# EasyEDA schematic SCH_ZeeMini - 2652p Board_2021-08-10.json
TITLE: ZeeMini - Prototype Board; REV: 1.0; Date: 2021-08-10; Sheet: 1/1; Drawn By: TrimVa; Company: Tech4You
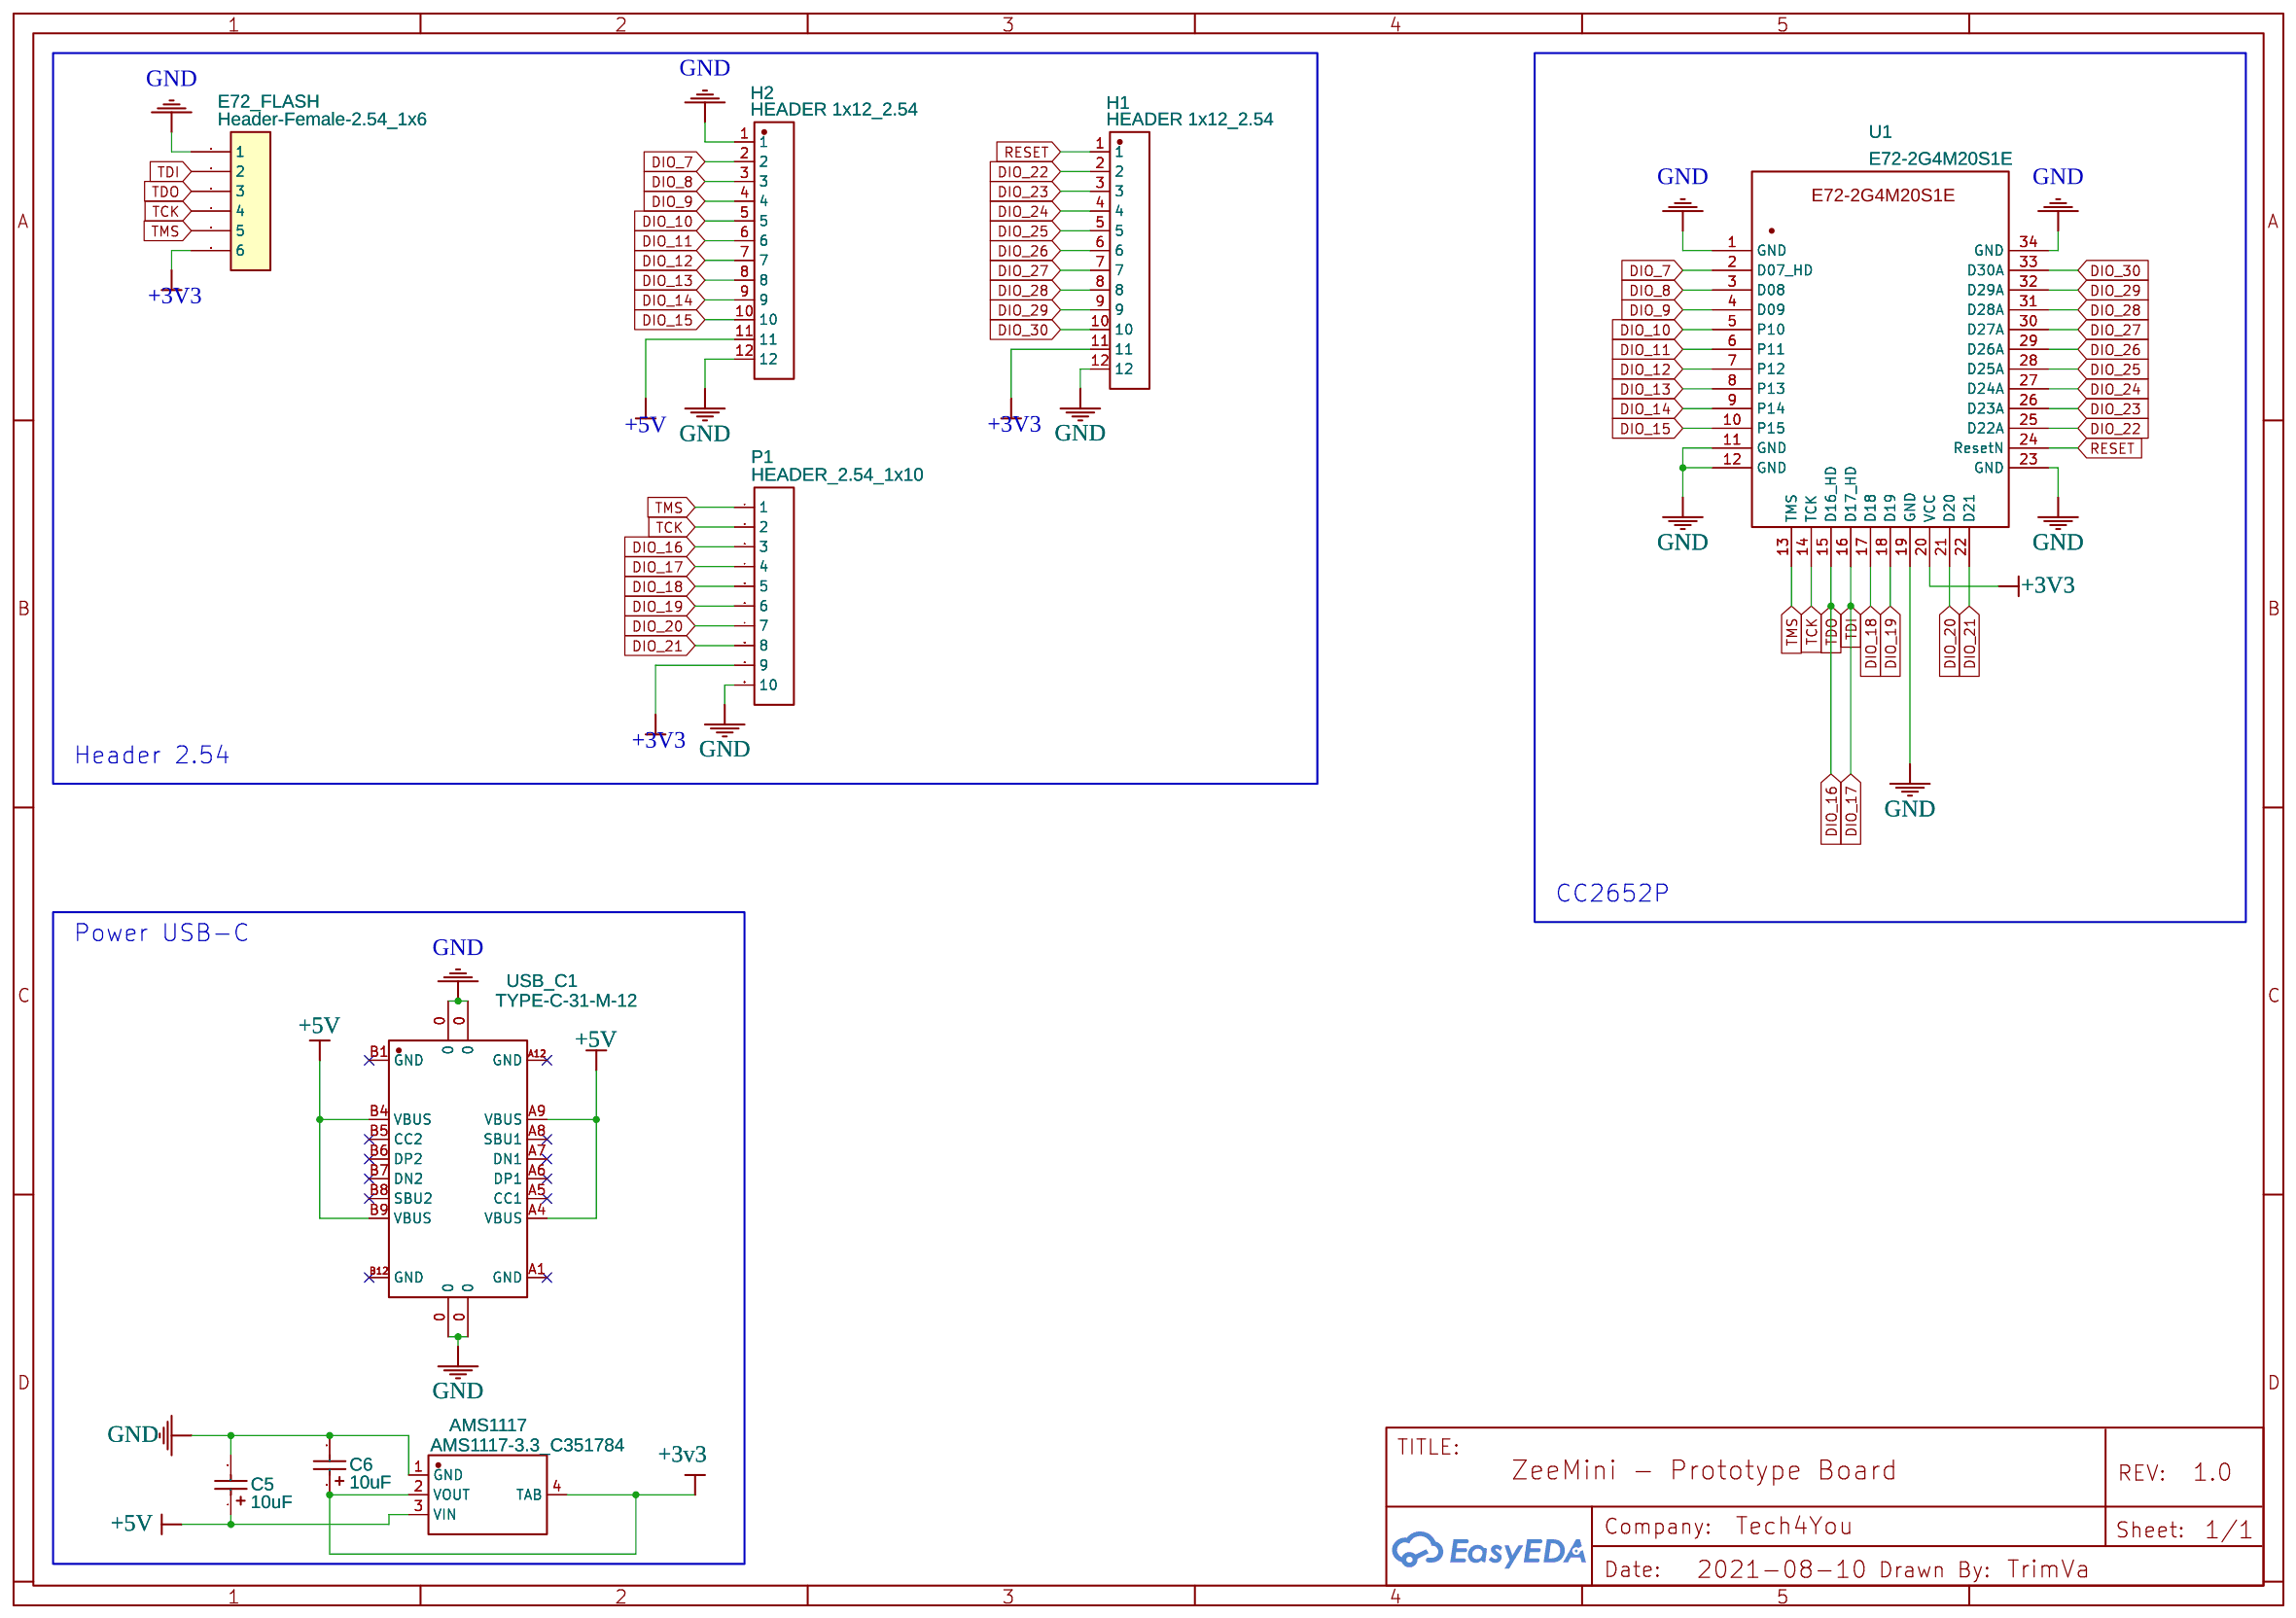
[diagram p0: schematic sheet]

## Parts
AMS1117  AMS1117-3.3_C351784  [SOT-223-3_L6.5-W3.4-P2.30-LS7.0-BR]
C5  10uF  [CAP-SMD_L3.2-W1.6-R-RD]
C6  10uF  [CAP-SMD_L3.2-W1.6-R-RD]
E72_FLASH  Header-Female-2.54_1x6  [1X6 PIN HEADER 2.54MM]
H1  HEADER 1x12_2.54  [HEADER 1X12_2.54]
H2  HEADER 1x12_2.54  [HEADER 1X12_2.54]
P1  HEADER_2.54_1x10  [HEADER_2.54_1X10_PCB]
U1  E72-2G4M20S1E  [E72-2G4M20S1E_]
USB_C1  TYPE-C-31-M-12  [USB-C_SMD-TYPE-C-31-M-12]

## Library data of the parts
AMS1117 = AMS1117-3.3_C351784: Supplier: LCSC; Supplier Part: C351784; Manufacturer: PUOLOP; Manufacturer Part: AMS1117-3.3; Contributor: LCSC; JLCPCB Part Class: Extended Part
C5 C6 = TAJA106K016RNJ: Supplier: LCSC; Manufacturer: AVX; Supplier Part: C7171; JLCPCB Part Class: Basic Part
E72_FLASH = Header-Female-2.54_1x6: Manufacturer Part: Female header/2.54mm2x3 Female header
H1 H2 = HEADER 1x12_2.54: Contributor: keunji yoo
P1 = HEADER_2.54_1x10: Manufacturer: BOOMELE; Manufacturer Part: Header-Male-2.54_1x6; Supplier Part: C37208; Contributor: andy-thx
U1 = E72-2G4M20S1E: Manufacturer: EBYTE; link: https://www.ebyte.com/en/downpdf.aspx?id=1002; Contributor: Palko
USB_C1 = TYPE-C-31-M-12: Supplier: LCSC; Supplier Part: C165948; Manufacturer: Rectangular Connectors - Contacts; Contributor: LCSC; JLCPCB Part Class: Extended Part

## Nets
+3V3: E72_FLASH.6 H1.11 P1.9 U1.20(VCC)
+3v3: AMS1117.2(VOUT) AMS1117.4(TAB) C6.1
+5V: AMS1117.3(VIN) C5.1 H2.11 USB_C1.A4(VBUS) USB_C1.A9(VBUS) USB_C1.B4(VBUS) USB_C1.B9(VBUS)
GND: AMS1117.1(GND) C5.2 C6.2 E72_FLASH.1 H1.12 H2.1 H2.12 P1.10 U1.1(GND) U1.11(GND) U1.12(GND) U1.19(GND) U1.23(GND) U1.34(GND) USB_C1.0
DIO_7: H2.2 U1.2(D07_HD)
DIO_8: H2.3 U1.3(D08)
DIO_9: H2.4 U1.4(D09)
DIO_10: H2.5 U1.5(P10)
DIO_11: H2.6 U1.6(P11)
DIO_12: H2.7 U1.7(P12)
DIO_13: H2.8 U1.8(P13)
DIO_14: H2.9 U1.9(P14)
DIO_15: H2.10 U1.10(P15)
DIO_16: E72_FLASH.3 P1.3 U1.15(D16_HD)
DIO_17: E72_FLASH.2 P1.4 U1.16(D17_HD)
DIO_18: P1.5 U1.17(D18)
DIO_19: P1.6 U1.18(D19)
DIO_20: P1.7 U1.21(D20)
DIO_21: P1.8 U1.22(D21)
DIO_22: H1.2 U1.25(D22A)
DIO_23: H1.3 U1.26(D23A)
DIO_24: H1.4 U1.27(D24A)
DIO_25: H1.5 U1.28(D25A)
DIO_26: H1.6 U1.29(D26A)
DIO_27: H1.7 U1.30(D27A)
DIO_28: H1.8 U1.31(D28A)
DIO_29: H1.9 U1.32(D29A)
DIO_30: H1.10 U1.33(D30A)
RESET: H1.1 U1.24(ResetN)
TCK: E72_FLASH.4 P1.2 U1.14(TCK)
TMS: E72_FLASH.5 P1.1 U1.13(TMS)

Not connected (* = marked no-connect by the designer): USB_C1 A1(GND)* A5(CC1)* A6(DP1)* A7(DN1)* A8(SBU1)* A12(GND)* B1(GND)* B5(CC2)* B6(DP2)* B7(DN2)* B8(SBU2)* B12(GND)*

## Notes on the sheet
- Header 2.54
- CC2652P
- Power USB-C
